# Altium project AT89xx Development Kit.PrjPcb
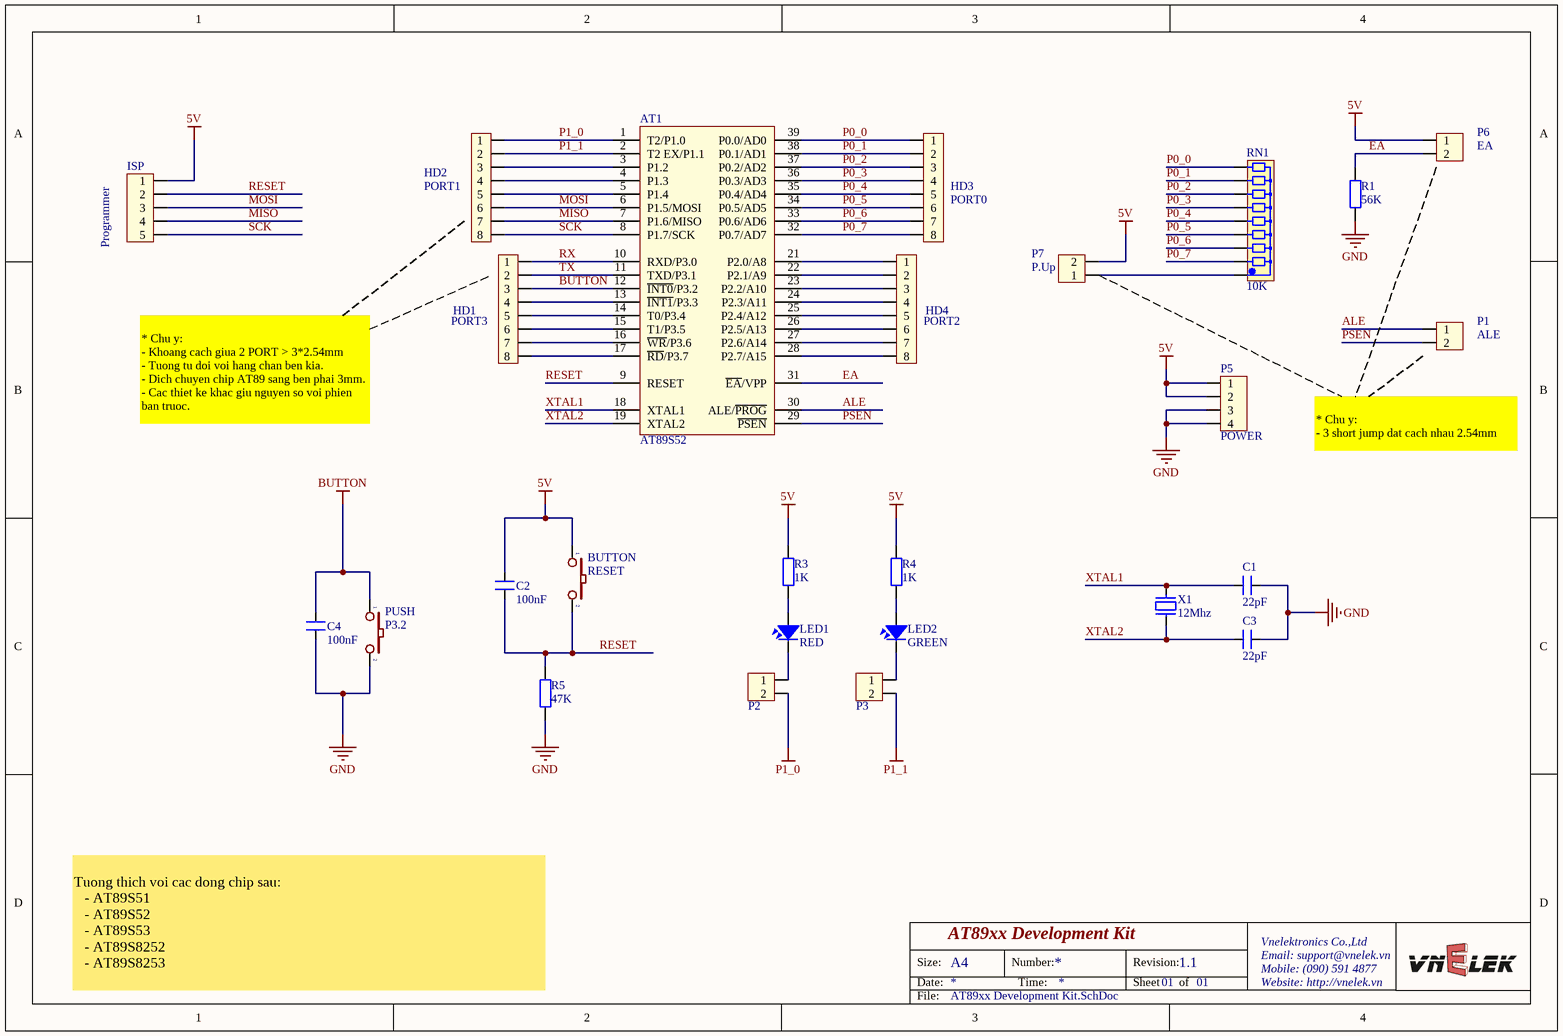
[diagram p0: AT89xx Development Kit.SchDoc]
2 sheets, 59 parts. Net scope: global (net labels, ports and power ports of the same name join across sheets).
Sheets:
  AT89xx Development Kit.SchDoc
  AT89xx Programmer.SchDoc

## Sheet AT89xx Development Kit.SchDoc: AT89xx Development Kit
size A4; Author: Tran Tuan; CompanyName: Vnelektronics Co.,Ltd; DrawnBy: Tran Tuan; Engineer: Tran Tuan; Organization: Vnelektronics Co.,Ltd; Address1: 776 Ton Duc Thang; Address2: Lien Chieu, Da Nang; Revision: 1.1; SheetNumber: 01; SheetTotal: 01; ProjectName: AT89xx Development Kit

### Parts
AT1  AT89S52  [de gat xanh dip 40]
BUTTON  RESET  [BUTTON 2PIN TRON]
C1  22pF  [C0603]
C2  100nF  [C0805]
C3  22pF  [C0603]
C4  100nF  [C0805]
HD1  PORT3  [Header_8]
HD2  PORT1  [Header_8]
HD3  PORT0  [Header_8]
HD4  PORT2  [Header_8]
ISP  Programmer  [Header_5]
LED1  RED  [Led 0805R]
LED2  GREEN  [Led 0805G]
P1  ALE  [Header_2]
P2  JUMP  [Header_2]  (value not drawn)
P3  JUMP  [Header_2]  (value not drawn)
P5  POWER  [Header_4]
P6  EA  [Header_2]
P7  P.Up  [Header_2]
PUSH  P3.2  [BUTTON 2PIN TRON]
R1  value 56K  [RESC2012(0805)]  (hidden comment: Res2)
R3  value 1K  [RESC2012(0805)]  (hidden comment: Res2)
R4  value 1K  [RESC2012(0805)]  (hidden comment: Res2)
R5  value 47K  [RESC2012(0805)]  (hidden comment: Res2)
RN1  10K  [RN8]
X1  12Mhz  [CRYSTAL]

### Nets
5V: AT1.40(5V) BUTTON.1 C2.1 ISP.1 P5.1 P5.2 P6.1 P7.2 R3.2 R4.2
BUTTON: AT1.12(~{INT0}/P3.2) C4.1 HD1.3 PUSH.1
GND: AT1.20(GND) C1.1 C3.1 C4.2 P5.3 P5.4 PUSH.2 R1.2 R5.2
P1_0: AT1.1(T2/P1.0) HD2.1 P2.2
P1_1: AT1.2(T2_EX/P1.1) HD2.2 P3.2
ALE: AT1.30(ALE/~{PROG}) P1.1
EA: AT1.31(~{EA}/VPP) P6.2 R1.1
MISO: AT1.7(P1.6/MISO) HD2.7 ISP.4
MOSI: AT1.6(P1.5/MOSI) HD2.6 ISP.3
P0_0: AT1.39(P0.0/AD0) HD3.1 RN1.9
P0_1: AT1.38(P0.1/AD1) HD3.2 RN1.8
P0_2: AT1.37(P0.2/AD2) HD3.3 RN1.7
P0_3: AT1.36(P0.3/AD3) HD3.4 RN1.6
P0_4: AT1.35(P0.4/AD4) HD3.5 RN1.5
P0_5: AT1.34(P0.5/AD5) HD3.6 RN1.4
P0_6: AT1.33(P0.6/AD6) HD3.7 RN1.3
P0_7: AT1.32(P0.7/AD7) HD3.8 RN1.2
PSEN: AT1.29(~{PSEN}) P1.2
RESET: AT1.9(RESET) BUTTON.2 C2.2 ISP.2 R5.1
RX: AT1.10(RXD/P3.0) HD1.1
SCK: AT1.8(P1.7/SCK) HD2.8 ISP.5
TX: AT1.11(TXD/P3.1) HD1.2
XTAL1: AT1.18(XTAL1) C1.2 X1.1
XTAL2: AT1.19(XTAL2) C3.2 X1.2
NetAT1_3: AT1.3(P1.2) HD2.3
NetAT1_4: AT1.4(P1.3) HD2.4
NetAT1_5: AT1.5(P1.4) HD2.5
NetAT1_13: AT1.13(~{INT1}/P3.3) HD1.4
NetAT1_14: AT1.14(T0/P3.4) HD1.5
NetAT1_15: AT1.15(T1/P3.5) HD1.6
NetAT1_16: AT1.16(~{WR}/P3.6) HD1.7
NetAT1_17: AT1.17(~{RD}/P3.7) HD1.8
NetAT1_21: AT1.21(P2.0/A8) HD4.1
NetAT1_22: AT1.22(P2.1/A9) HD4.2
NetAT1_23: AT1.23(P2.2/A10) HD4.3
NetAT1_24: AT1.24(P2.3/A11) HD4.4
NetAT1_25: AT1.25(P2.4/A12) HD4.5
NetAT1_26: AT1.26(P2.5/A13) HD4.6
NetAT1_27: AT1.27(P2.6/A14) HD4.7
NetAT1_28: AT1.28(P2.7/A15) HD4.8
NetLED1_1: LED1.1 R3.1
NetLED1_2: LED1.2 P2.1
NetLED2_1: LED2.1 R4.1
NetLED2_2: LED2.2 P3.1
NetP7_1: P7.1 RN1.1

### Notes on the sheet
- * Chu y:
  - Khoang cach giua 2 PORT > 3*2.54mm
  - Tuong tu doi voi hang chan ben kia.
  - Dich chuyen chip AT89 sang ben phai 3mm.
  - Cac thiet ke khac giu nguyen so voi phien ban truoc.
- * Chu y:
  - 3 short jump dat cach nhau 2.54mm
- Tuong thich voi cac dong chip sau:
  - AT89S51
  - AT89S52
  - AT89S53
  - AT89S8252
  - AT89S8253
- Size:
- Date:
- A4
- Number:
- Time:
- Revision:
- Sheet
- of
- Vnelektronics Co.,Ltd
- Mobile: (090) 591 4877
- Email: support@vnelek.vn
- Website: http://vnelek.vn
- File:

### Library data of the parts
AT1 = AT89S52: AT89S52, 8k Byte Flash Memory , 40 Pin; Value: AT89S52
BUTTON PUSH = SW2: Switch button 2 pin; Value: SW chip 2 pin
C1-C4 = CN1: Cap np  1pF - 472pF; Value: 100pF
HD1-HD4 = Hed8: Hedear 8; Creat by: VanDungEvn@Gmail.com
ISP = Hed5: Header 5 (Green); Value: Header 5
LED1 LED2 = LED: LED Single colour Green and Red; Value: LED 3 ly Single Colour
P1-P3 P6 P7 = Hed2: Header 2 (Green); Value: Header 2
P5 = Con4: Connector 4; Value: Connector 4
R1 R3-R5 = Res2: Resistor; Published: 8-Jun-2000; LatestRevisionDate: 17-Jul-2002; LatestRevisionNote: Re-released for DXP Platform.; PackageReference: AXIAL-0.4; Publisher: Altium Limited; PackageDescription: Axial Device, Thru-Hole; 2 Leads; 0.4 in Pin Spacing
RN1 = RN8: Resistor 8 (Thanh); Value: Tro thanh 10K
X1 = XT2: Crystal For all Crystal 2pin.; Value: 4Mhz

## Sheet AT89xx Programmer.SchDoc: AT89xx Programmer
size A4; Author: Tran Tuan; CompanyName: Vnelektronics Co.,Ltd; DrawnBy: Tran Tuan; Engineer: Tran Tuan; Organization: Vnelektronics Co.,Ltd; Address1: 776 Ton Duc Thang; Address2: Lien Chieu, Da Nang; Revision: 1.1; SheetNumber: 01; SheetTotal: 01; ProjectName: AT89xx Programmer
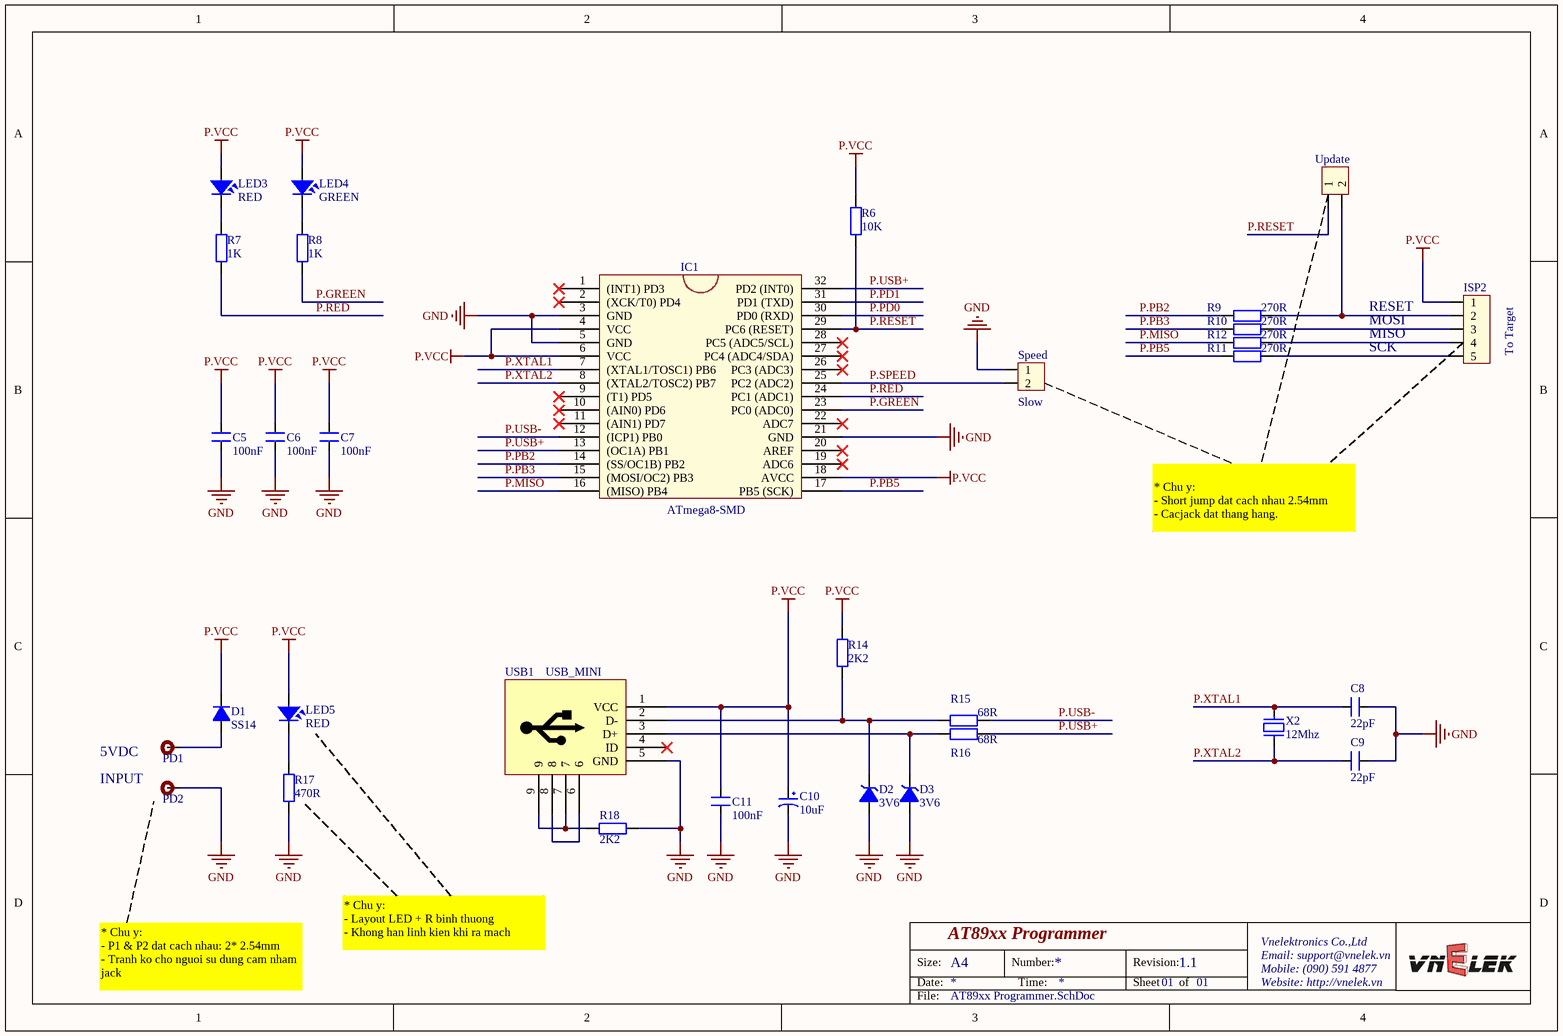
[diagram p1: AT89xx Programmer.SchDoc]

### Parts
C5  100nF  [C0805]
C6  100nF  [C0805]
C7  100nF  [C0805]
C8  22pF  [C0603]
C9  22pF  [C0603]
C10  10uF  [C1210]
C11  100nF  [C0805]
D1  SS14  [SS14]
D2  3V6  [1N5223]
D3  3V6  [1N5223]
IC1  ATmega8-SMD  [ATMEGA_8_SMD]
ISP2  To Target  [Header_5]
LED3  RED  [Led 0805R]
LED4  GREEN  [Led 0805G]
LED5  RED  [Led 0805R]
PD1  Pad Big  (value not drawn)
PD2  Pad Big  (value not drawn)
R6  value 10K  [RESC2012(0805)]  (hidden comment: Res2)
R7  value 1K  [RESC2012(0805)]  (hidden comment: Res2)
R8  value 1K  [RESC2012(0805)]  (hidden comment: Res2)
R9  value 270R  [RESC2012(0805)]  (hidden comment: Res2)
R10  value 270R  [RESC2012(0805)]  (hidden comment: Res2)
R11  value 270R  [RESC2012(0805)]  (hidden comment: Res2)
R12  value 270R  [RESC2012(0805)]  (hidden comment: Res2)
R14  value 2K2  [RESC2012(0805)]  (hidden comment: Res2)
R15  value 68R  [RESC2012(0805)]  (hidden comment: Res2)
R16  value 68R  [RESC2012(0805)]  (hidden comment: Res2)
R17  value 470R  [RESC2012(0805)]  (hidden comment: Res2)
R18  value 2K2  [RESC2012(0805)]  (hidden comment: Res2)
Speed  Slow  [Header_2]
Update  Update  [Header_2]  (value not drawn)
USB1  USB_MINI  [USBMNIB]
X2  12Mhz  [CRYSTAL]

### Nets
GND: C5.1 C6.1 C7.1 C8.1 C9.1 C10.2 C11.1 D2.1(A) D3.1(A) IC1.3(GND) IC1.5(GND) IC1.21(GND) PD2.1 R17.2 R18.2 Speed.1 USB1.5(GND)
P.VCC: C5.2 C6.2 C7.2 C10.1 C11.2 D1.2(K) IC1.4(VCC) IC1.6(VCC) IC1.18(AVCC) ISP2.1 LED3.1 LED4.1 LED5.1 R6.2 R14.1 USB1.1(VCC)
P.GREEN: IC1.23(PC0_(ADC0)) R8.2
P.MISO: IC1.16((MISO)_PB4) R12.1
P.PB2: IC1.14((SS/OC1B)_PB2) R9.1
P.PB3: IC1.15((MOSI/OC2)_PB3) R10.1
P.PB5: IC1.17(PB5_(SCK)) R11.1
P.PD0: IC1.30(PD0_(RXD))
P.PD1: IC1.31(PD1_(TXD))
P.RED: IC1.24(PC1_(ADC1)) R7.2
P.RESET: IC1.29(PC6_(RESET)) R6.1 Update.1
P.SPEED: IC1.25(PC2_(ADC2)) Speed.2
P.USB+: IC1.13((OC1A)_PB1) IC1.32(PD2_(INT0)) R16.1
P.USB-: IC1.12((ICP1)_PB0) R15.1
P.XTAL1: C8.2 IC1.7((XTAL1/TOSC1)_PB6) X2.1
P.XTAL2: C9.2 IC1.8((XTAL2/TOSC2)_PB7) X2.2
NetD1_1: D1.1(A) PD1.1
NetD2_2: D2.2(K) R14.2 R15.2 USB1.2(D-)
NetD3_2: D3.2(K) R16.2 USB1.3(D+)
NetISP2_2: ISP2.2 R9.2 Update.2
NetISP2_3: ISP2.3 R10.2
NetISP2_4: ISP2.4 R12.2
NetISP2_5: ISP2.5 R11.2
NetLED3_2: LED3.2 R7.1
NetLED4_2: LED4.2 R8.1
NetLED5_2: LED5.2 R17.1
NetR18_1: R18.1 USB1.7 USB1.9
NetUSB1_6: USB1.6 USB1.8

Not connected (* = marked no-connect by the designer): IC1 1((INT1)_PD3)* 2((XCK/T0)_PD4)* 9((T1)_PD5)* 10((AIN0)_PD6)* 11((AIN1)_PD7)* 19(ADC6)* 20(AREF)* 22(ADC7)* 26(PC3_(ADC3))* 27(PC4_(ADC4/SDA))* 28(PC5_(ADC5/SCL))*; USB1 4(ID)*

### Notes on the sheet
- RESET
- MOSI
- MISO
- SCK
- * Chu y:
  - Short jump dat cach nhau 2.54mm
  - Cacjack dat thang hang.
- 5VDC
- INPUT
- * Chu y:
  - P1 & P2 dat cach nhau: 2* 2.54mm
  - Tranh ko cho nguoi su dung cam nham jack
- * Chu y:
  - Layout LED + R binh thuong
  - Khong han linh kien khi ra mach
- Size:
- Date:
- A4
- Number:
- Time:
- Revision:
- Sheet
- of
- Vnelektronics Co.,Ltd
- Mobile: (090) 591 4877
- Email: support@vnelek.vn
- Website: http://vnelek.vn
- File:

### Library data of the parts
C5-C7 C11 = CN2: Cap np 104 => 105pF; Value: 0.1uF
C8 C9 = CN1: Cap np  1pF - 472pF; Value: 100pF
C10 = CP1: Cap P  0,1uF < 22uF , 16 - 50V; Value: 10uF/50V; Description 1: 10 => 220uF/6,3V/10V - 10uF => 100uF/16V; Description 2: 0,1uF => 33uF/50V - 10uF => 22uF/63V; Description 3: 0,47uF => 10uF/100V
D1 = D1A: Diode 1A; Value: 1N4007
D2 D3 = DZ: Diode Zenner; Value: 3v3
IC1 = ATmega8_SMD_32pin: High-performance, Low-power Atmel  ®  AVR  ®   8-bit Microcontroller
ISP2 = Hed5: Header 5 (Green); Value: Header 5
LED3-LED5 = LED: as LED1 on sheet AT89xx Development Kit
PD1 PD2 = Pad_Big: Value: Pad Big - Hole
R6-R12 R14-R18 = Res2: Resistor; Published: 8-Jun-2000; LatestRevisionDate: 17-Jul-2002; LatestRevisionNote: Re-released for DXP Platform.; PackageReference: AXIAL-0.4; Publisher: Altium Limited; PackageDescription: Axial Device, Thru-Hole; 2 Leads; 0.4 in Pin Spacing
Speed Update = Hed2: Header 2 (Green); Value: Header 2
X2 = XT2: as X1 on sheet AT89xx Development Kit

## Nets that join several sheets
GND: AT89xx Development Kit (9 pins), AT89xx Programmer (17 pins)